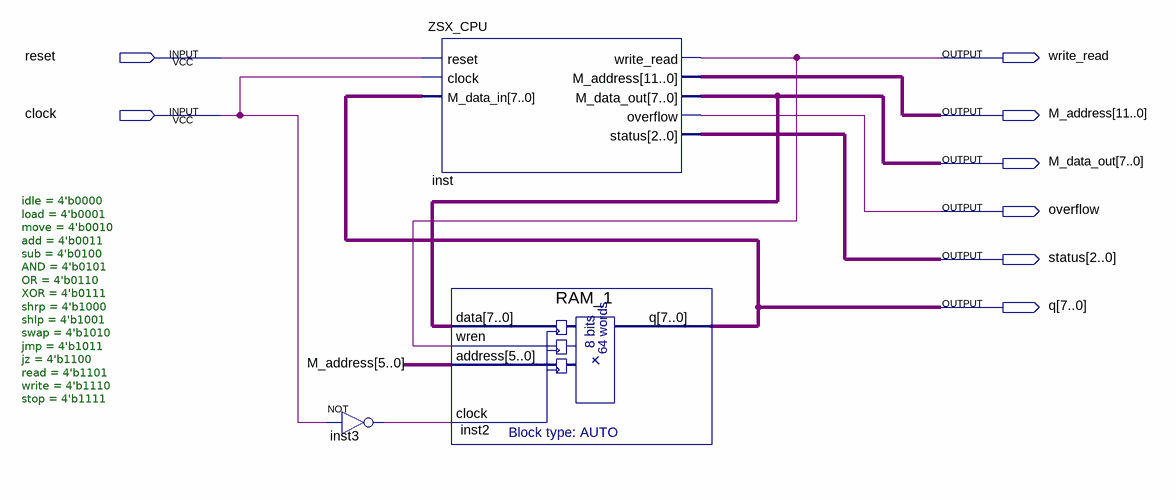
[diagram p0: schematic sheet]
// Quartus schematic Computer.bdf as structural Verilog: 3 symbols, 8 pins
module Computer (
  input  reset,
  input  clock,
  output write_read,
  output [11:0] M_address,
  output [7:0] M_data_out,
  output overflow,
  output [2:0] status,
  output [7:0] q
);

  wire inst3_out;

  not inst3 (inst3_out, clock);
  ZSX_CPU #(.idle(4'b0000), .load(4'b0001), .move(4'b0010), .add(4'b0011), .sub(4'b0100), .AND(4'b0101), .OR(4'b0110), .XOR(4'b0111), .shrp(4'b1000), .shlp(4'b1001), .swap(4'b1010), .jmp(4'b1011), .jz(4'b1100), .read(4'b1101), .write(4'b1110), .stop(4'b1111)) inst (
    .reset(reset), .clock(clock), .M_data_in(q), .write_read(write_read), .M_address(M_address),
    .M_data_out(M_data_out), .overflow(overflow), .status(status));
  RAM_1 inst2 (.data(M_data_out), .wren(write_read), .address(M_address[5:0]), .clock(inst3_out), .q(q));
endmodule
